# EAGLE design Arduino_Shield_RC_Controller (EAGLE 9.6.2)
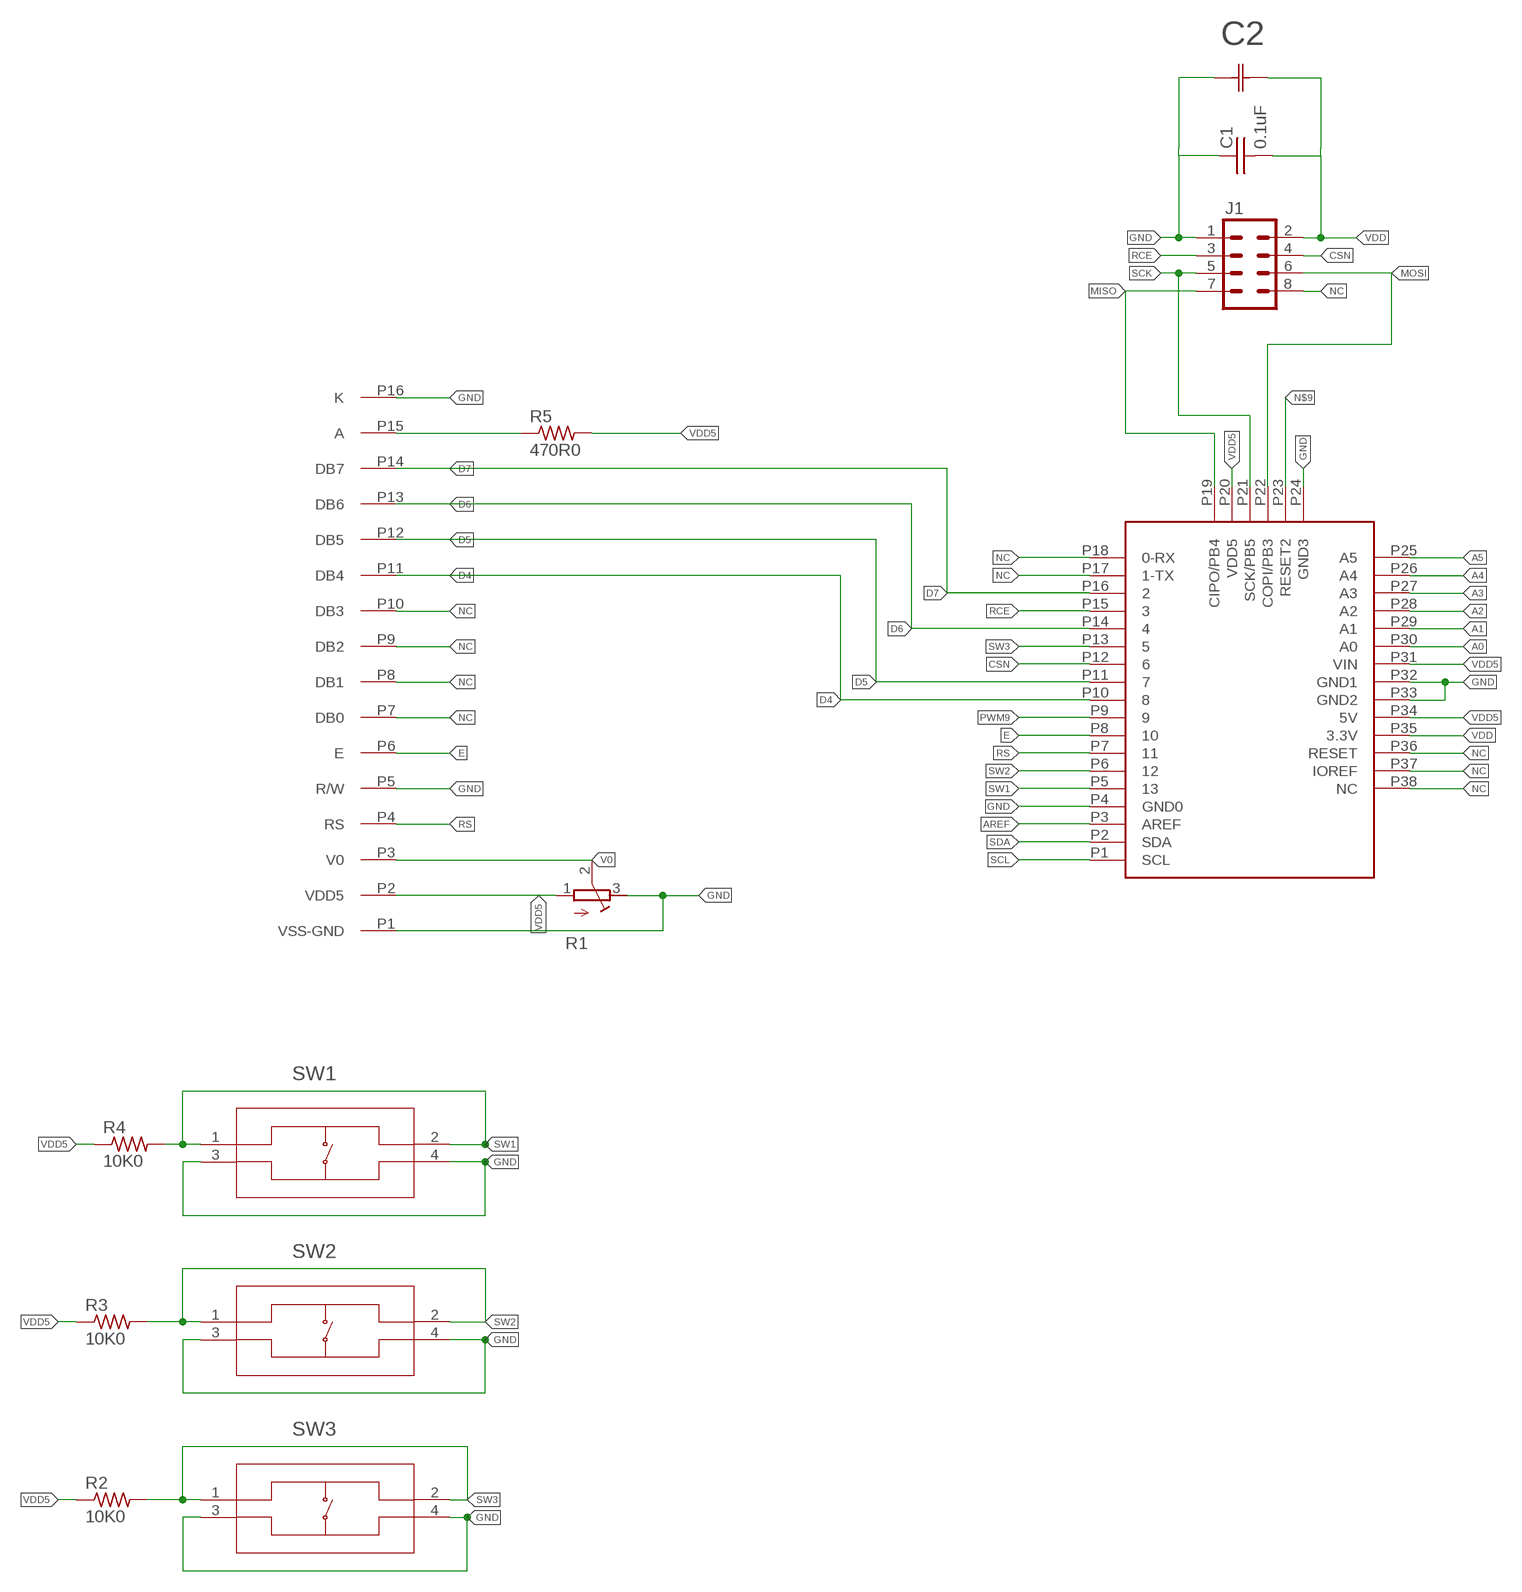
[diagram p0: schematic, sheet 1]

## Parts
AR1  ARDUINO_R3  [ARDUINO_R3]
C1  0.1uF  C_0402_0.1UF  [0402]
C2  CAP_470UF_RAD_TH  [CAP_YX_10X16_RUB]
J1  CONN_04X2  [2X4]
LCD1  ADM1602K  [ADM1602K]
R1  R-TRIMM3103  [RTRIM3103]
R2  10K0  R_0402_10K0  [0402]
R3  10K0  R_0402_10K0  [0402]
R4  10K0  R_0402_10K0  [0402]
R5  470R0  R_0402_470R0  [0402]
SW1  PTS810SJG250SMTRLFS  [PTS810]
SW2  PTS810SJG250SMTRLFS  [PTS810]
SW3  PTS810SJG250SMTRLFS  [PTS810]

## Nets
A0: AR1.P30(A0)
A1: AR1.P29(A1)
A2: AR1.P28(A2)
A3: AR1.P27(A3)
A4: AR1.P26(A4)
A5: AR1.P25(A5)
AREF: AR1.P3(AREF)
CSN: AR1.P12 J1.4
D4: AR1.P10 LCD1.P11(DB4)
D5: AR1.P11 LCD1.P12(DB5)
D6: AR1.P14 LCD1.P13(DB6)
D7: AR1.P16 LCD1.P14(DB7)
E: AR1.P8 LCD1.P6(E)
GND: AR1.P4(GND0) AR1.P24(GND3) AR1.P32(GND1) AR1.P33(GND2) C1.P$1 C2.1 J1.1 LCD1.P1(VSS-GND) LCD1.P5(R/W) LCD1.P16(K) R1.3(E) SW1.3 SW1.4 SW2.3 SW2.4 SW3.3 SW3.4
MISO: AR1.P19(CIPO/PB4) J1.7
MOSI: AR1.P22(COPI/PB3) J1.6
N$9: AR1.P23(RESET2)
N$39: LCD1.P15(A) R5.P$1
NC: AR1.P17(1-TX) AR1.P18(0-RX) AR1.P36(RESET) AR1.P37(IOREF) AR1.P38(NC) J1.8 LCD1.P7(DB0) LCD1.P8(DB1) LCD1.P9(DB2) LCD1.P10(DB3)
PWM9: AR1.P9
RCE: AR1.P15 J1.3
RS: AR1.P7 LCD1.P4(RS)
SCK: AR1.P21(SCK/PB5) J1.5
SCL: AR1.P1(SCL)
SDA: AR1.P2(SDA)
SW1: AR1.P5 R4.P$2 SW1.1 SW1.2
SW2: AR1.P6 R3.P$2 SW2.1 SW2.2
SW3: AR1.P13 R2.P$2 SW3.1 SW3.2
V0: LCD1.P3(V0) R1.2(S)
VDD: AR1.P35(3.3V) C1.P$2 C2.2 J1.2
VDD5: AR1.P20(VDD5) AR1.P31(VIN) AR1.P34(5V) LCD1.P2(VDD5) R1.1(A) R2.P$1 R3.P$1 R4.P$1 R5.P$2

## Library data of the parts
AR1 = 3D_MIG_Controller:ARDUINO_R3
C1 = 3D_MIG_Controller:C_0402_0.1UF; PARTNO: CL05F104ZO5NNNC
C2 = 3D_MIG_Controller:CAP_470UF_RAD_TH; COPYRIGHT: Copyright (C) 2023 Ultra Librarian. All rights reserved.; DIGIKEY_PART_NUMBER_1: 1189-1890-ND; MANUFACTURER_PART_NUMBER: 35ZLH470MEFC10X16; MFR_NAME: Rubycon
J1 = 3D_MIG_Controller:CONN_04X2: Multi connection point. Often used as Generic Header-pin footprint for 0.1 inch spaced/style header connections For AVR SPI programming port, see special device with nice symbol: "AVR_SPI_PROG_5x2.dev" You can populate with any combo of single row headers, but if you'd like an exact match, check these: 2x5 AVR ICSP Male Header <https://www.sparkfun.com/products/778> (PRT-00778) 2x5 Pin Shrouded Header <https://www.sparkfun.com/products/8506> (PRT-08506) On any of the 0.1 inch spaced packages, you can populate with these: Break Away Headers - Straight <https://www.sparkfun.com/products/116> (PRT-00116) Break Away Male Headers - Right Angle <https://www.sparkfun.com/products/553> (PRT-00553) Female Headers <https://www.sparkfun.com/products/115> (PRT-00115) Break Away Headers - Machine Pin <https://www.sparkfun.com/products/117> (PRT-00117) Break Away Female Headers - Swiss Machine Pin <https://www.sparkfun.com/products/743> (PRT-00743) Special note: the shrouded connector mates well with our 5x2 ribbon cables: 2x5 Pin IDC Ribbon Cable <https://www.sparkfun.com/products/8535> (PRT-08535)
LCD1 = 3D_MIG_Controller:ADM1602K
R1 = 3D_MIG_Controller:R-TRIMM: Trimm resistor
R2-R4 = 3D_MIG_Controller:R_0402_10K0; PARTNO: RMCF0402JT10K0
R5 = 3D_MIG_Controller:R_0402_470R0; PARTNO: RMCF0402JT470R
SW1-SW3 = 3D_MIG_Controller:PTS810SJG250SMTRLFS; BUILT_BY: EMA_Cory; COPYRIGHT: Copyright (C) 2018 Accelerated Designs. All rights reserved; DATASHEET: https://www.ckswitches.com/products/tactile/PTS810/#PTS810SJG250SMTRLFS; MANUFACTURER_PART_NUMBER: PTS810SJG250SMTRLFS; VENDOR: C&K

## Board
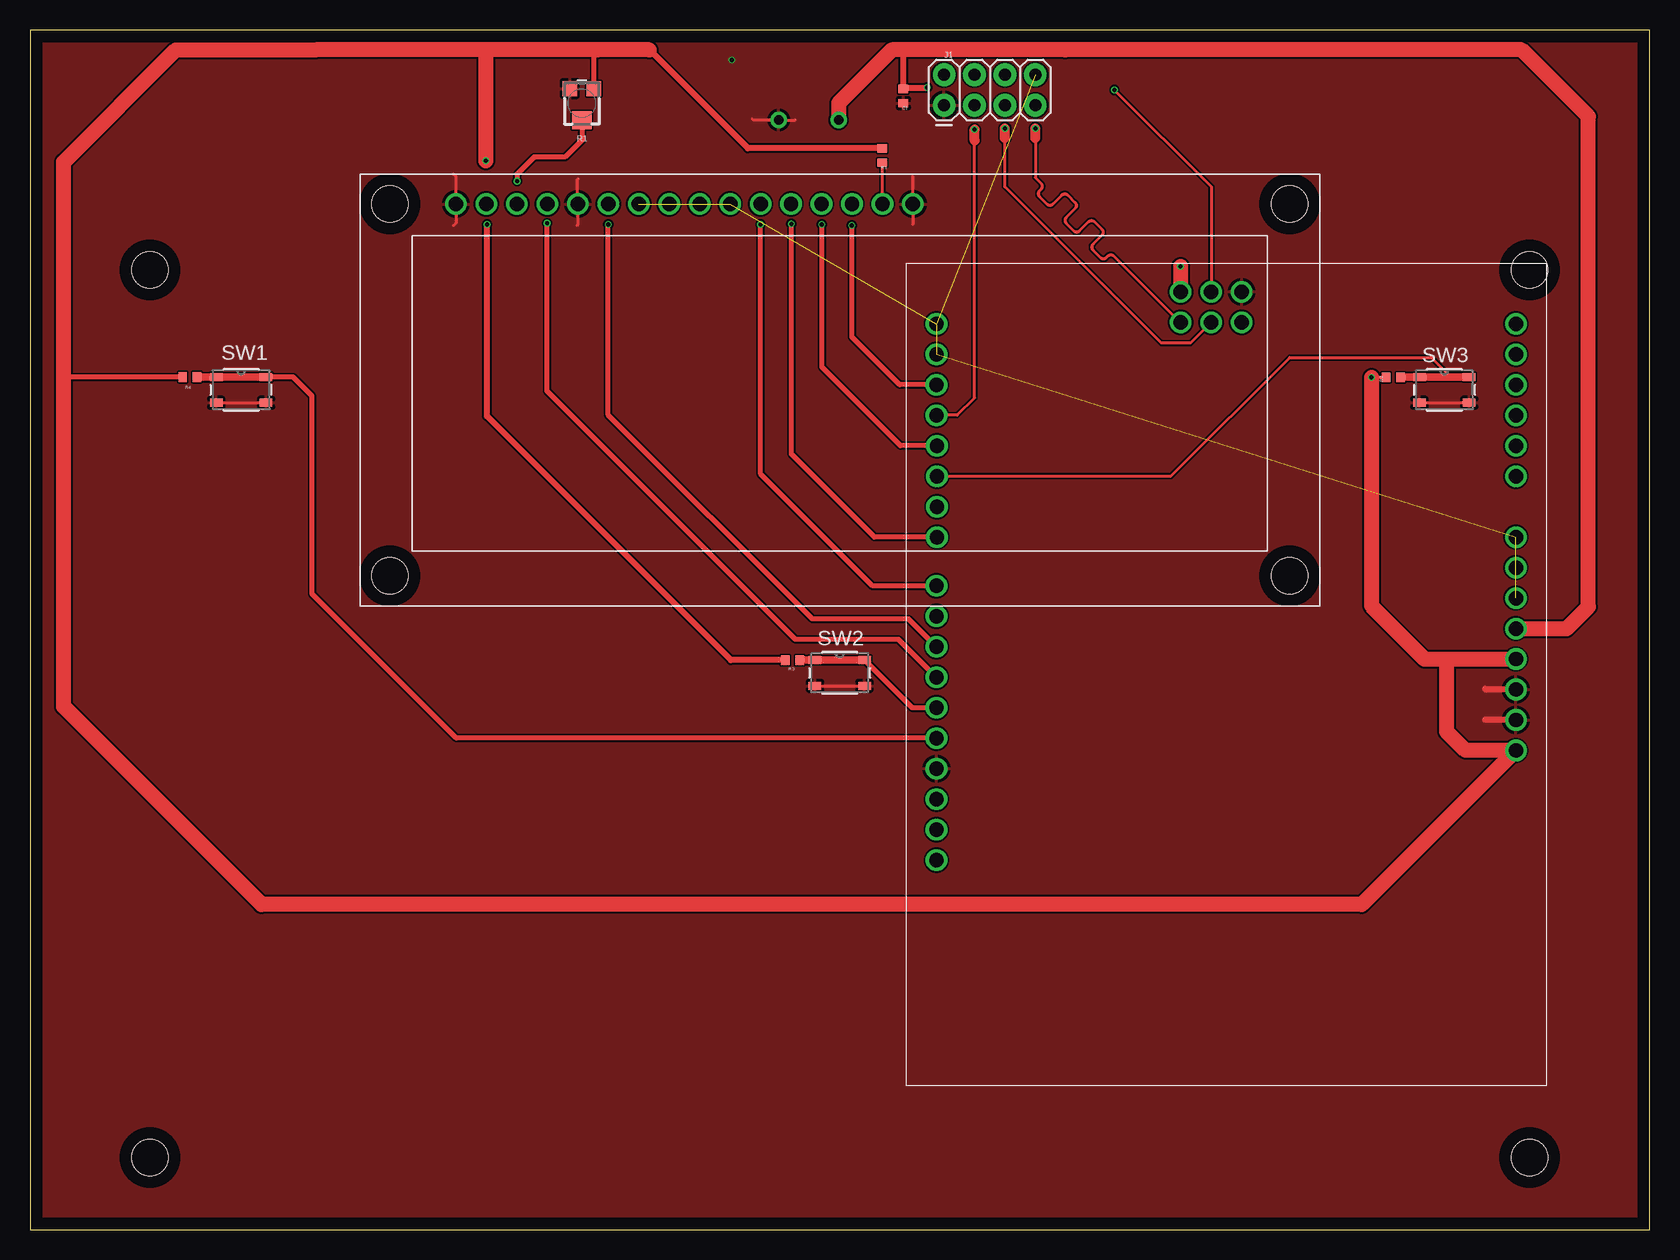
[diagram p1: board, top side]
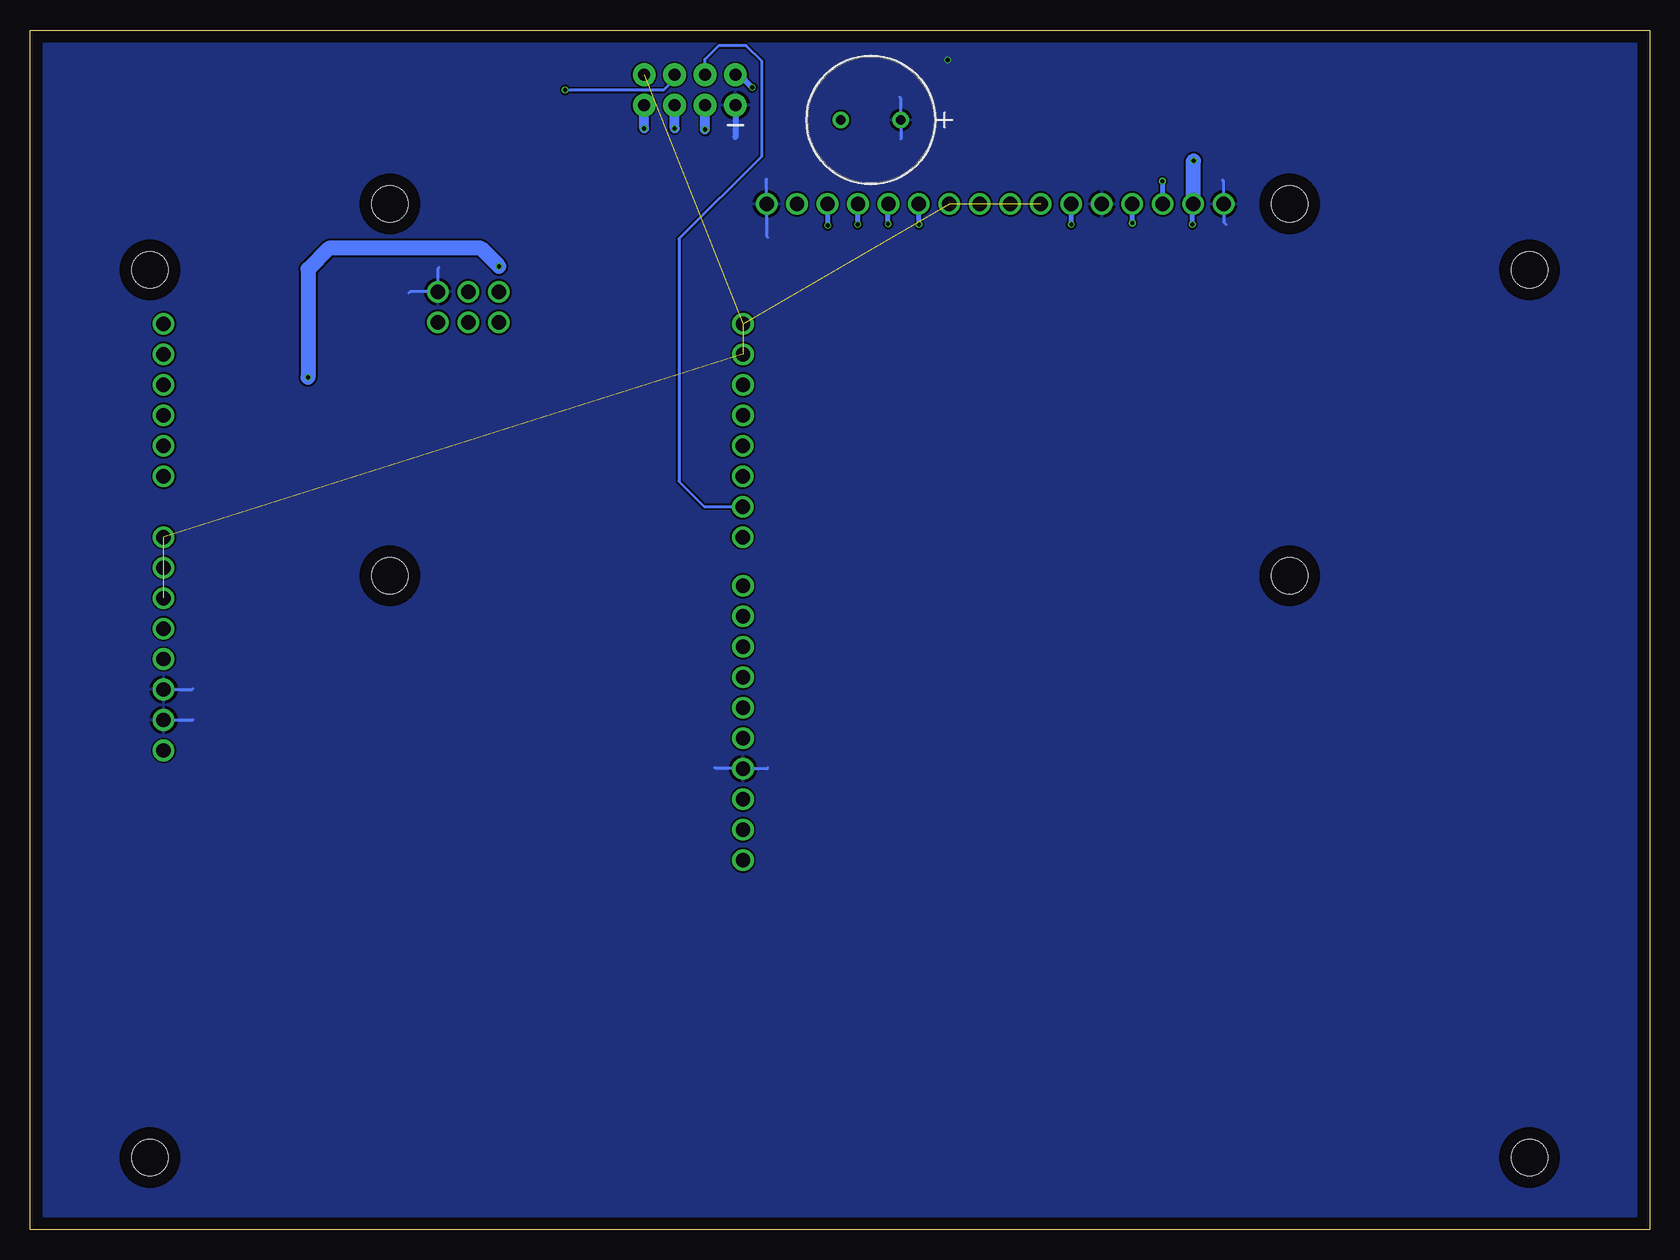
[diagram p2: board, bottom side, seen from below]

Size 135 x 100 mm. Coordinates in mm from the lower left corner, seen from the top.
Outline: 0,0 135,0 135,100 0,100 0,0
Copper layers (1*16): Top 0.035mm / dielectric 1.5mm / Bottom 0.035mm
Design rules "default *": minimum track width 6mil, minimum drill 0.2mm, track to track 6mil, track to pad 6mil, pad to pad 6mil, via to via 6mil, smd to smd 6mil, copper to edge 40mil, drill to drill 6mil, minimum pad ring 10mil, minimum via ring 4mil, stop-mask expansion 4mil, vias tented up to drill 0mil, thermal gap 10mil
Holes 3 mm at 10,6 125,6 125,80 10,80

### Footprints (pad centres in the part's own frame; a part is rotated, then mirrored left to right if it is on the bottom)
ARDUINO_R3 = drill 1.2: P1 18.8,50.84; P2 21.34,50.84; P3 23.88,50.84; P4 26.42,50.84; P5 28.96,50.84; P6 31.5,50.84; P7 34.04,50.84; P8 36.58,50.84; P9 39.12,50.84; P10 41.66,50.84; P11 45.72,50.8; P12 48.26,50.8; P13 50.8,50.8; P14 53.34,50.8; P15 55.88,50.84; P16 58.42,50.84; P17 60.96,50.84; P18 63.5,50.84; P19 63.627,30.48; P20 66.167,30.48; P21 63.627,27.94; P22 66.167,27.94; P23 63.627,25.4; P24 66.167,25.4; P25 50.8,2.54; P26 53.34,2.54; P27 55.88,2.54; P28 58.42,2.54; P29 60.96,2.54; P30 63.5,2.54; P31 27.94,2.54; P32 30.48,2.54; P33 33.02,2.54; P34 35.56,2.54; P35 38.1,2.54; P36 40.64,2.54; P37 43.18,2.54; P38 45.72,2.54
0402 = smd 0.8 x 0.7: P$1 0,0.6; P$2 0,-0.6
CAP_YX_10X16_RUB = drill 0.795 pad 1.372: 1 0,0; 2 5.004,0
2X4 = drill 1 pad 1.88: 1 -3.81,-1.27; 2 -3.81,1.27; 3 -1.27,-1.27; 4 -1.27,1.27; 5 1.27,-1.27; 6 1.27,1.27; 7 3.81,-1.27; 8 3.81,1.27
ADM1602K = drill 1.2: P1 -32,15.5; P2 -29.46,15.5; P3 -26.92,15.5; P4 -24.38,15.5; P5 -21.84,15.5; P6 -19.3,15.5; P7 -16.76,15.5; P8 -14.22,15.5; P9 -11.68,15.5; P10 -9.14,15.5; P11 -6.6,15.5; P12 -4.06,15.5; P13 -1.52,15.5; P14 1.02,15.5; P15 3.56,15.5; P16 6.1,15.5 | hole 3: -37.5,-15.5; 37.5,-15.5; 37.5,15.5; -37.5,15.5
RTRIM3103 = smd 1.2 x 1.25: 1 -1,-1.225; 3 1,-1.225 | smd 1.6 x 1.5: 2 0,1.4
PTS810 = smd 1.041 x 0.66: 1 -2.075,1.075; 2 2.075,1.075; 3 -2.075,-1.075; 4 2.075,-1.075

### Placement (x,y rotation side)
AR1  126.4,12 90 top
C1  72.8,94.5 180 top
C2  62.4,92.5 180 bottom
J1  80,95 0 top
LCD1  67.5,70 0 top
R1  46,93.9 180 top
R2  113.65,71.04 90 top
R3  63.55,47.47 90 top
R4  13.33,71.06 90 top
R5  71.05,89.54 180 top
SW1  17.6,70 0 top
SW2  67.5,46.4 0 top
SW3  117.9,70 0 top

### Tracks (layer width: path | path; a pad name or v marks a point on that pad's centre or on a via)
CSN
  Bottom 0.254: J1.4 78.73,97.57 77.6,98.7 75.3,98.7 74,97.4 74,89.5 80.9,82.6 80.9,62.36 78.8,60.26 AR1.P12
D4  (via drill 0.35)
  Top 0.406: AR1.P10 70.24,53.66 60.9,63 v60.9,83.8
  Bottom 0.406: v60.9,83.8 LCD1.P11
D5  (via drill 0.35)
  Top 0.406: AR1.P11 70.38,57.72 63.47,64.63 v63.47,83.83
  Bottom 0.406: v63.47,83.83 63.47,85.47 LCD1.P12
D6  (via drill 0.35)
  Top 0.406: AR1.P14 72.56,65.34 66,71.9 v66,83.8
  Bottom 0.406: v66,83.8 65.98,83.82 LCD1.P13
D7  (via drill 0.35)
  Top 0.406: AR1.P16 72.48,70.42 68.5,74.4 v68.5,83.7
  Bottom 0.406: v68.5,83.7 68.5,85.48 LCD1.P14
E  (via drill 0.35)
  Top 0.406: AR1.P8 73.24,50.9 65.21,50.9 48.2,67.91 v48.2,83.8
  Bottom 0.406: v48.2,83.8 LCD1.P6
GND  (via drill 0.35)
  Top 0.254: SW2.3 67.08,45.33 67.1,45.3 69.55,45.3 SW2.4 | SW3.3 SW3.4 | SW1.3 SW1.4 | 60.2,92.6 60.3,92.5 C2.1 63.8,92.5 | 73.6,83.8 LCD1.P16 73.6,87.8 | 35.3,88 35.5,87.8 LCD1.P1 35.5,83.9 35.3,83.7 | 45.7,87.6 45.66,87.56 LCD1.P5 45.66,83.76 45.6,83.7
  Top 0.508: AR1.P33 121.38,45.02 121.3,45.1 | AR1.P32 121.32,42.48 121.3,42.5
  Bottom 0.254: 62.5,94.4 62.4,94.3 C2.1 62.4,90.9 | 73.5,82.7 73.6,82.8 LCD1.P16 73.6,87.6 | 35.3,83.8 35.5,84 LCD1.P1 35.5,87.4 35.6,87.5 | 100.9,80.2 101,80.1 AR1.P24 103.33,78.17 103.4,78.1 | AR1.P32 121.42,42.48 121.4,42.5 | AR1.P33 121.48,45.02 121.4,45.1 | 77.9,38.5 77.82,38.42 AR1.P4 73.58,38.42 73.5,38.5
  Bottom 0.508: J1.1 76.19,91.11 76.2,91.1
  other vias: 58.5,97.5
  pour Top: 0,100.2 135,100.2 135,0 0,0
  pour Bottom: 0,100.1 135,100.1 135,0 0,0
MISO  (via drill 0.35)
  Top 0.254: 83.81,91 83.81,87.69 84.27,87.23 arc-90 84.27,86.72 84.15,86.61 arc90 84.15,86.1 84.77,85.49 arc90 85.27,85.49 86.01,86.23 arc-90 86.51,86.23 87.12,85.62 arc-90 87.12,85.12 86.38,84.38 arc90 86.38,83.87 87,83.26 arc90 87.5,83.26 88.24,84 arc-90 88.74,84 89.35,83.39 arc-90 89.35,82.89 88.61,82.15 arc90 88.61,81.64 89.23,81.03 arc90 89.73,81.03 89.85,81.15 arc-90 90.35,81.15 95.87,75.63 AR1.P19
  Top 0.813: 83.81,91 v83.81,91.8
  Bottom 0.813: v83.81,91.8 J1.7
MOSI  (via drill 0.35)
  Top 0.254: AR1.P22 98.46,86.94 v90.4,95
  Bottom 0.254: v90.4,95 82.2,95 81.27,95.93 J1.6
N$39
  Top 0.254: LCD1.P15 R5.P$1
NC  (9 unrouted)
RCE  (via drill 0.35)
  Top 0.254: 78.73,90.8 78.73,69.33 77.28,67.88 AR1.P15
  Top 0.813: 78.73,90.8 v78.73,91.7
  Bottom 0.813: v78.73,91.7 J1.3
RS  (via drill 0.35)
  Top 0.406: AR1.P7 72.4,49.2 63.8,49.2 43.1,69.9 v43.1,83.9
  Bottom 0.406: v43.1,83.9 43.1,85.48 LCD1.P4
SCK  (via drill 0.35)
  Top 0.254: AR1.P21 96.73,73.9 94.3,73.9 81.27,86.93 81.27,91
  Top 0.813: 81.27,91 v81.27,91.8
  Bottom 0.813: v81.27,91.8 J1.5
SW1
  Top 0.406: AR1.P5 35.54,40.96 23.5,53 23.5,69.5 21.93,71.08 SW1.2
  Top 0.61: SW1.2 SW1.1 15.51,71.06 R4.P$2
SW2
  Top 0.406: AR1.P6 73.55,43.5 SW2.2
  Top 0.61: R3.P$2 SW2.1 SW2.2
SW3
  Top 0.254: SW3.2 118.42,71.08 116.8,72.7 105,72.7 95.1,62.8 AR1.P13
  Top 0.61: SW3.2 SW3.1 114.28,71.08 R2.P$2
V0  (via drill 0.35)
  Top 0.406: R1.2 46,90.8 44.6,89.4 42,89.4 40.6,88 v40.6,87.4
  Bottom 0.406: v40.6,87.4 40.6,85.52 LCD1.P3
VDD  (via drill 0.35)
  Top 0.508: 72.8,98.35 C1.P$2 72.9,95.2 v74.8,95.2
  Top 1.27: AR1.P35 128.1,50.1 129.9,51.9 129.9,92.8 124.35,98.35 86.3,98.35 72.8,98.35 71.85,98.35 67.4,93.9 C2.2
  Bottom 0.508: v74.8,95.2 75.87,96.27 J1.2
VDD5  (via drill 0.35)
  Top 0.254: 23.55,98.35 23.8,98.35 | v111.82,71.05 R2.P$1
  Top 0.406: R4.P$1 2.86,71.06 2.8,71 | R1.1 47,98.05 47.3,98.35
  Top 0.508: R3.P$1 58.43,47.47 38.1,67.8 v38.1,83.8 | R5.P$2 59.85,90.14 51.64,98.35
  Top 1.27: 51.64,98.35 47.3,98.35 37.7,98.35 | 37.7,98.35 23.8,98.35 12.15,98.35 2.8,89 2.8,71 2.8,43.6 19.3,27.1 111.02,27.1 AR1.P31 119.66,39.94 118.1,41.5 118.1,47.56 | AR1.P20 95.92,80.28 v95.9,80.3 | v111.82,71.05 111.82,51.98 116.24,47.56 118.1,47.56 | 118.1,47.56 AR1.P34 | v38,89.1 38,98.05 37.7,98.35
  Bottom 0.406: v38.1,83.8 38.1,85.44 LCD1.P2
  Bottom 1.27: v95.9,80.3 97.4,81.8 110.1,81.8 111.82,80.08 v111.82,71.05 | LCD1.P2 38.04,89.06 v38,89.1